# Altium schematic sheet Camera_Interface.SCHDOC: Apalis Evaluation Board 1.1
size A3; Organization: Toradex AG; Address1: Altsagenstrasse 5; Address2: Horw; Address3: 6048; Address4: Switzerland; DocumentNumber: 16; Revision: V1.1; SheetNumber: 16; SheetTotal: 32; PageSetup: Record=PageOptions|CenterHorizontal=True|CenterVertical=True|PrintScale=0.73|XCorrection=1.00|YCorrection=1.00|PrintKind=0|BorderSize=5000000|LeftOffset=0|BottomOffset=0|Orientation=2|PaperLength=1000|PaperWidth=1000|Scale=100|PaperSource=7|PrintQuality=-4|MediaType=1|DitherType=10|PaperKind=A4|PrintScaleMode=1
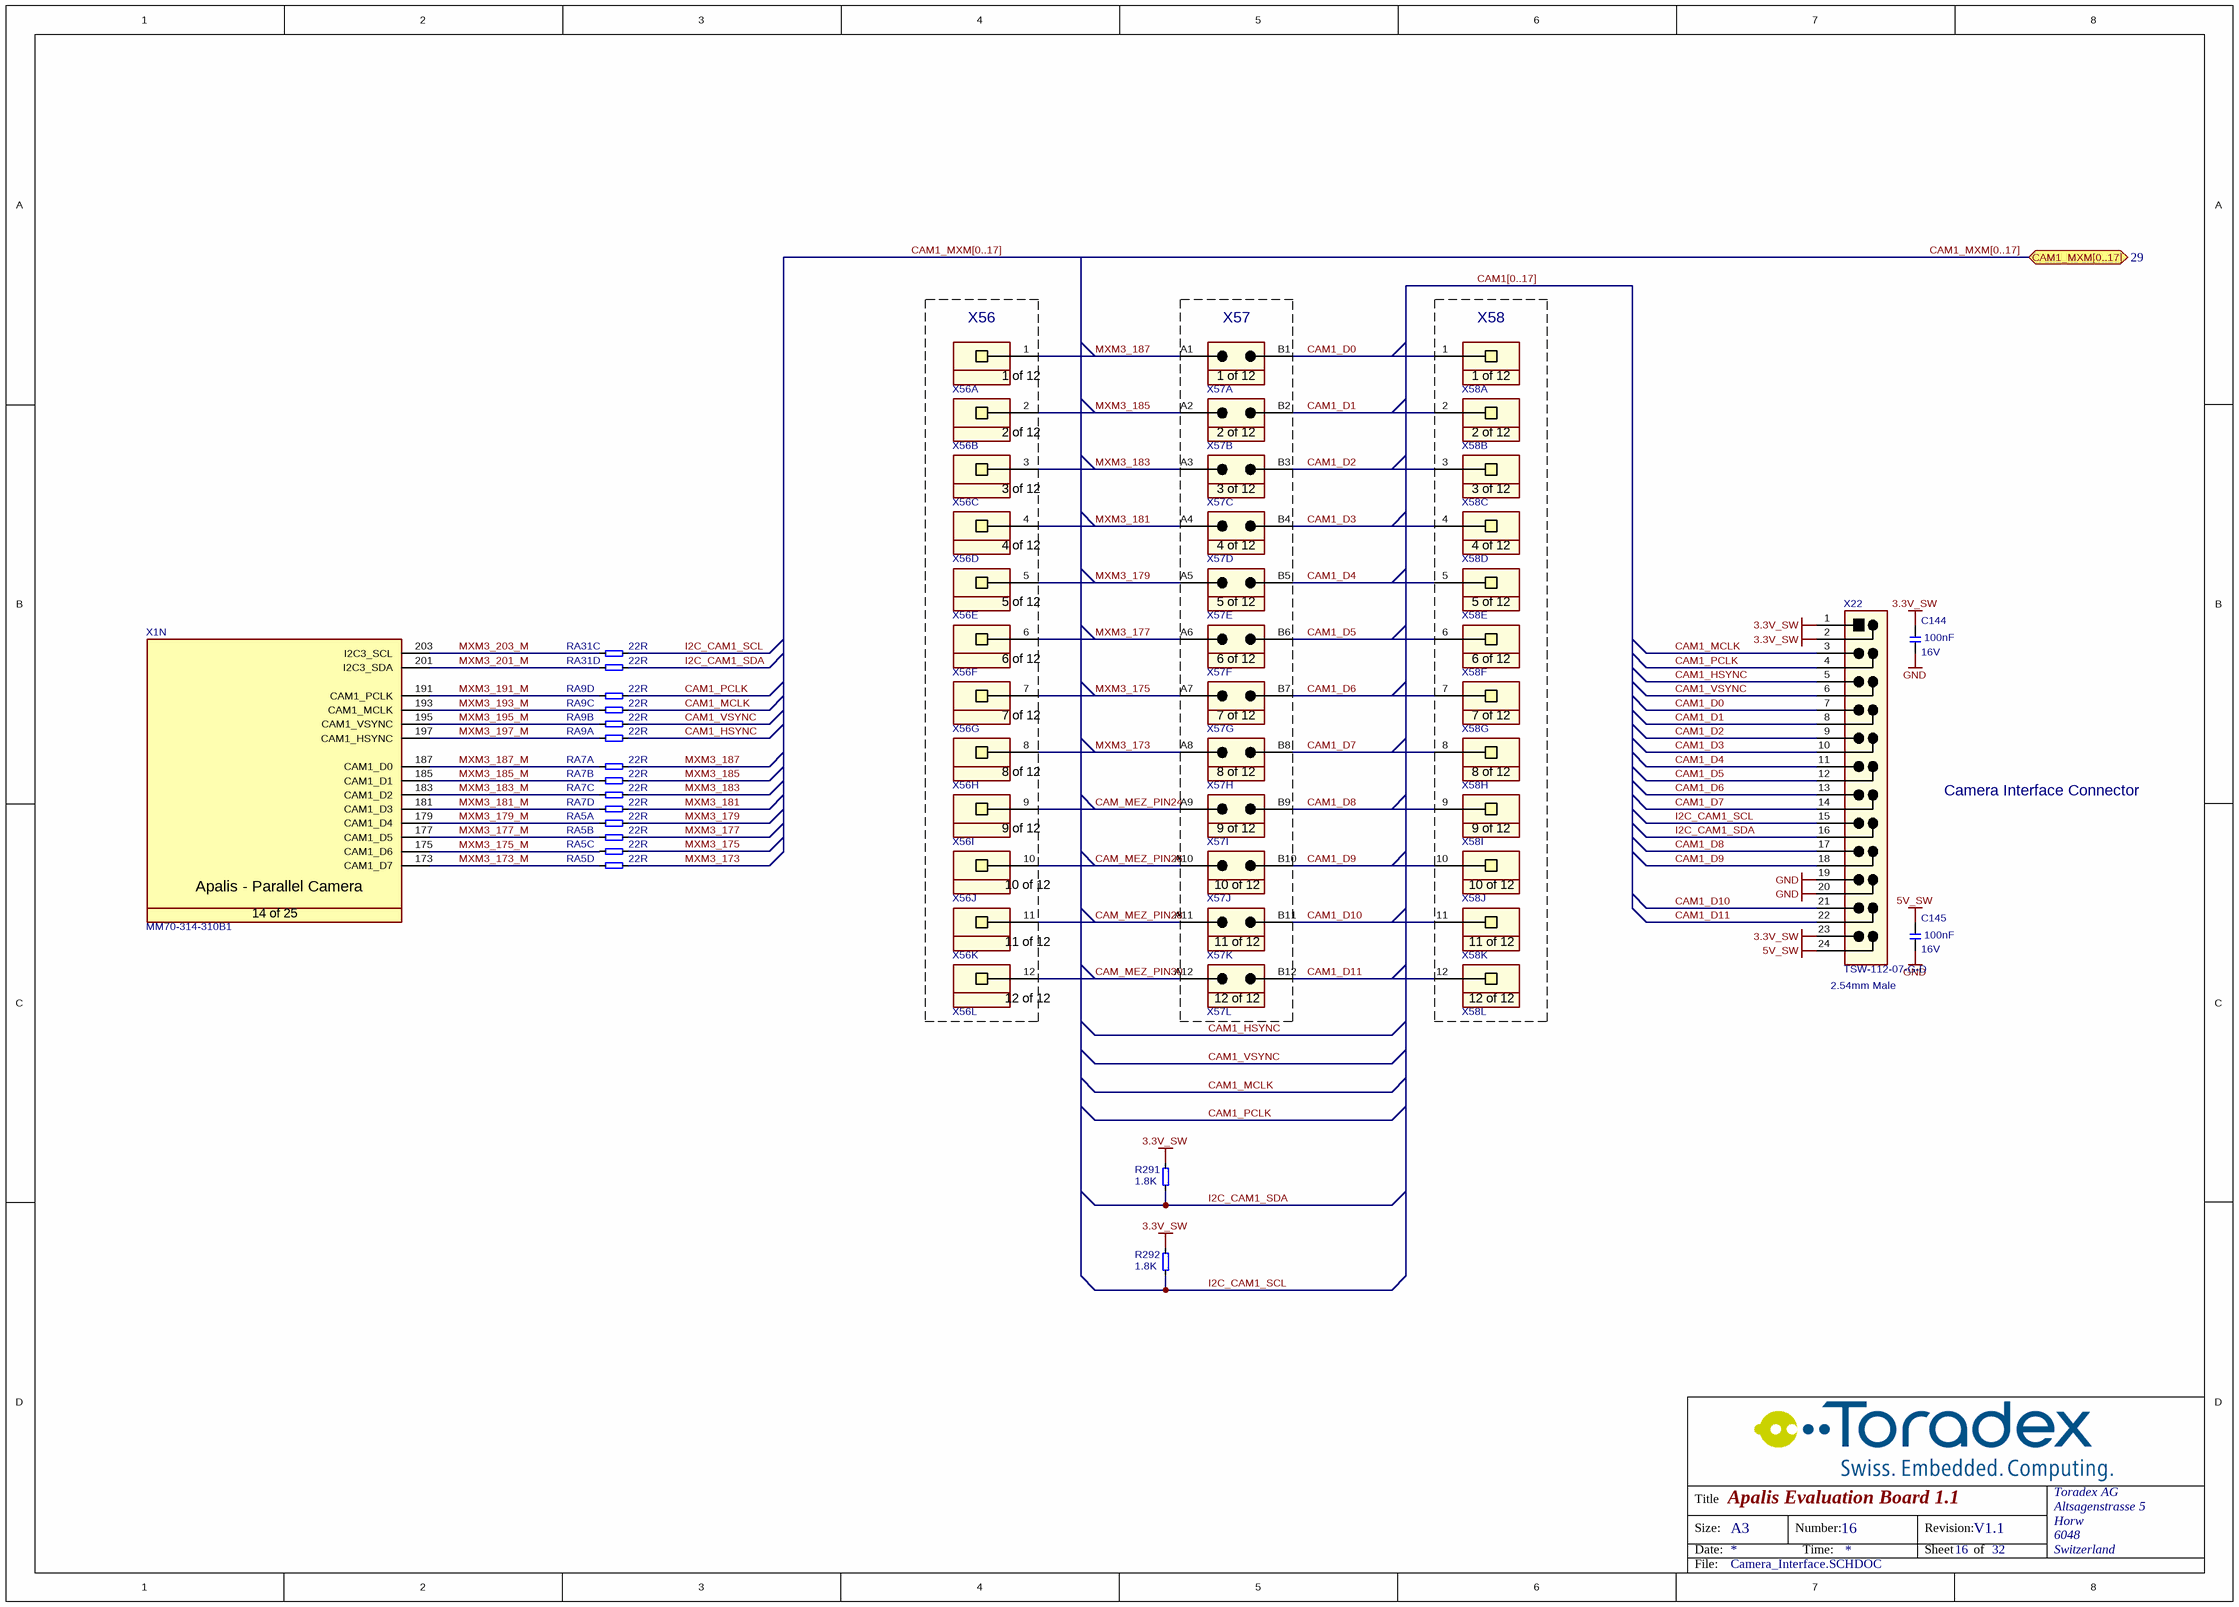
[diagram p0: Camera_Interface.SCHDOC]

## Parts
C144  Rating: 16V  [T_CAPC0603X33N]  (hidden comment: 100nF)
C145  Rating: 16V  [T_CAPC0603X33N]  (hidden comment: 100nF)
R291  1.8K  [T_RESC0603X30N]
R292  1.8K  [T_RESC0603X30N]
RA5  22R  [T_Resistor_Array_X4]  (parts A,B,C,D of 4)
RA7  22R  [T_Resistor_Array_X4]  (parts A,B,C,D of 4)
RA9  22R  [T_Resistor_Array_X4]  (parts A,B,C,D of 4)
RA31  22R  [T_Resistor_Array_X4]  (parts C,D of 4)
X1  Manufacturer Part No.: MM70-314-310B1  [T_JAE_MM70-314-310B1]  (hidden comment: CON-JAE-MM70-314-310B1-314-0.5mm)  (part N of 25)
X22  TSW-112-07-G-D  [T_Samtec_TSW-112-07-G-D-HEADER]
X56  SSW-112-01-G-S  [T_Samtec_SSW-112-01-G-S]  (value not drawn)  (parts A,B,C,D,E,F,G,H,I,J,K,L of 12)
X57  TSW-112-07-G-D  [T_Samtec_TSW-112-07-G-D]  (value not drawn)  (parts A,B,C,D,E,F,G,H,I,J,K,L of 12)
X58  SSW-112-01-G-S  [T_Samtec_SSW-112-01-G-S]  (value not drawn)  (parts A,B,C,D,E,F,G,H,I,J,K,L of 12)

## Blocks framed on the sheet
X56: X56
X57: X57
X58: X58

## Ports
CAM1_MXM[0..17] (bidir, see 29)

## Nets
3.3V_SW: C144.2 R291.1 R292.1 X22.1 X22.2 X22.23
5V_SW: C145.2 X22.24
GND: C144.1 C145.1 X22.19 X22.20
CAM1_D0: X22.7 X57.B1 X58.1
CAM1_D1: X22.8 X57.B2 X58.2
CAM1_D2: X22.9 X57.B3 X58.3
CAM1_D3: X22.10 X57.B4 X58.4
CAM1_D4: X22.11 X57.B5 X58.5
CAM1_D5: X22.12 X57.B6 X58.6
CAM1_D6: X22.13 X57.B7 X58.7
CAM1_D7: X22.14 X57.B8 X58.8
CAM1_D8: X22.17 X57.B9 X58.9
CAM1_D9: X22.18 X57.B10 X58.10
CAM1_D10: X22.21 X57.B11 X58.11
CAM1_D11: X22.22 X57.B12 X58.12
CAM1_HSYNC: RA9.5 X22.5
CAM1_MCLK: RA9.7 X22.3
CAM1_PCLK: RA9.8 X22.4
CAM1_VSYNC: RA9.6 X22.6
CAM_MEZ_PIN24: X56.9 X57.A9
CAM_MEZ_PIN26: X56.10 X57.A10
CAM_MEZ_PIN28: X56.11 X57.A11
CAM_MEZ_PIN30: X56.12 X57.A12
I2C_CAM1_SCL: R292.2 RA31.7 X22.15
I2C_CAM1_SDA: R291.2 RA31.8 X22.16
MXM3_173: RA5.8 X56.8 X57.A8
MXM3_173_M: RA5.4 X1.173(CAM1_D7)
MXM3_175: RA5.7 X56.7 X57.A7
MXM3_175_M: RA5.3 X1.175(CAM1_D6)
MXM3_177: RA5.6 X56.6 X57.A6
MXM3_177_M: RA5.2 X1.177(CAM1_D5)
MXM3_179: RA5.5 X56.5 X57.A5
MXM3_179_M: RA5.1 X1.179(CAM1_D4)
MXM3_181: RA7.8 X56.4 X57.A4
MXM3_181_M: RA7.4 X1.181(CAM1_D3)
MXM3_183: RA7.7 X56.3 X57.A3
MXM3_183_M: RA7.3 X1.183(CAM1_D2)
MXM3_185: RA7.6 X56.2 X57.A2
MXM3_185_M: RA7.2 X1.185(CAM1_D1)
MXM3_187: RA7.5 X56.1 X57.A1
MXM3_187_M: RA7.1 X1.187(CAM1_D0)
MXM3_191_M: RA9.4 X1.191(CAM1_PCLK)
MXM3_193_M: RA9.3 X1.193(CAM1_MCLK)
MXM3_195_M: RA9.2 X1.195(CAM1_VSYNC)
MXM3_197_M: RA9.1 X1.197(CAM1_HSYNC)
MXM3_201_M: RA31.4 X1.201(I2C3_SDA)
MXM3_203_M: RA31.3 X1.203(I2C3_SCL)

## Buses and harness runs
bus CAM1[0..17]
bus CAM1_MXM[0..17] = port CAM1_MXM[0..17]

## Notes on the sheet
- Camera Interface Connector
- (near X22) 2.54mm Male
- Title
- Size:
- Date:
- A3
- Number:
- Time:
- Revision:
- Sheet
- of
- File:
- (in symbol CON-JAE-MM70-314-310B1-314-0.5mm, part N) Apalis - Parallel Camera; 14 of 25
- (in symbol CON-Samtec-SSW-112-01-G-S, part A) 1 of 12
- (in symbol CON-Samtec-SSW-112-01-G-S, part B) 2 of 12
- (in symbol CON-Samtec-SSW-112-01-G-S, part C) 3 of 12
- (in symbol CON-Samtec-SSW-112-01-G-S, part D) 4 of 12
- (in symbol CON-Samtec-SSW-112-01-G-S, part E) 5 of 12
- (in symbol CON-Samtec-SSW-112-01-G-S, part F) 6 of 12
- (in symbol CON-Samtec-SSW-112-01-G-S, part G) 7 of 12
- (in symbol CON-Samtec-SSW-112-01-G-S, part H) 8 of 12
- (in symbol CON-Samtec-SSW-112-01-G-S, part I) 9 of 12
- (in symbol CON-Samtec-SSW-112-01-G-S, part J) 10 of 12
- (in symbol CON-Samtec-SSW-112-01-G-S, part K) 11 of 12
- (in symbol CON-Samtec-SSW-112-01-G-S, part L) 12 of 12
- (in symbol CON-Samtec-TSW-112-07-G-D, part A) 1 of 12
- (in symbol CON-Samtec-TSW-112-07-G-D, part B) 2 of 12
- (in symbol CON-Samtec-TSW-112-07-G-D, part C) 3 of 12
- (in symbol CON-Samtec-TSW-112-07-G-D, part D) 4 of 12
- (in symbol CON-Samtec-TSW-112-07-G-D, part E) 5 of 12
- (in symbol CON-Samtec-TSW-112-07-G-D, part F) 6 of 12
- (in symbol CON-Samtec-TSW-112-07-G-D, part G) 7 of 12
- (in symbol CON-Samtec-TSW-112-07-G-D, part H) 8 of 12
- (in symbol CON-Samtec-TSW-112-07-G-D, part I) 9 of 12
- (in symbol CON-Samtec-TSW-112-07-G-D, part J) 10 of 12
- (in symbol CON-Samtec-TSW-112-07-G-D, part K) 11 of 12
- (in symbol CON-Samtec-TSW-112-07-G-D, part L) 12 of 12

## Library data of the parts
C144 C145 = C-X7R-100nF-16V-10%-0603: Capacitor Ceramic X7R 100nF 16V 10% 0603; Tolerance: 10%; Type: X7R; Value: 100nF
R291 R292 = R-1.8KR-63mW-5%-0603: Resistor 1.8 Kohm 63mW 5% 0603; Value: 1.8KR; Rating: 63mW; Tolerance: 5%
RA5 RA7 RA9 RA31 = RA-22R-63mW-5%-1206-div: Resistor Array 22 R 63mW 5% 1206; Tolerance: 5%; Power Dissipation: 63mW
  RA5 RA7 RA31: Value: 22R
X1 = CON-JAE-MM70-314-310B1-314-0.5mm: MXM3 Connector; Manufacturer Name: JAE; No. of ways: 314
X22 = CON-Samtec-TSW-112-07-G-D-Header: Header male, 2x12 Pins, 2.54 mm pitch; Manufacturer Name: Samtec; Pitch: 2.54 mm; No. of ways: 2x12; Manufacturer Part No.: TSW-112-07-G-D
X56 X58 = CON-Samtec-SSW-112-01-G-S: Header 1x12 pin 2.54mm pitch; Manufacturer Name: Samtec; Pitch: 2.54mm; No. of ways: 1x12; Manufacturer Part No.: SSW-112-01-G-S
X57 = CON-Samtec-TSW-112-07-G-D: Header 2x12 pin 2.54mm pitch; Manufacturer Name: Samtec; Pitch: 2.54mm; No. of ways: 2x12; Manufacturer Part No.: TSW-112-07-G-D